# Altium project SVPXFMC_Carrier_6U.PrjPcb (part 4 of 9)

## Sheet FPGA SDRAM bank.SchDoc
size A3
Used 2 times, as channels FMC Carrier Channel1/U_FPGA SDRAM bank, FMC Carrier Channel2/U_FPGA SDRAM bank. Parts and nets are listed once, with the designators drawn on the sheet.
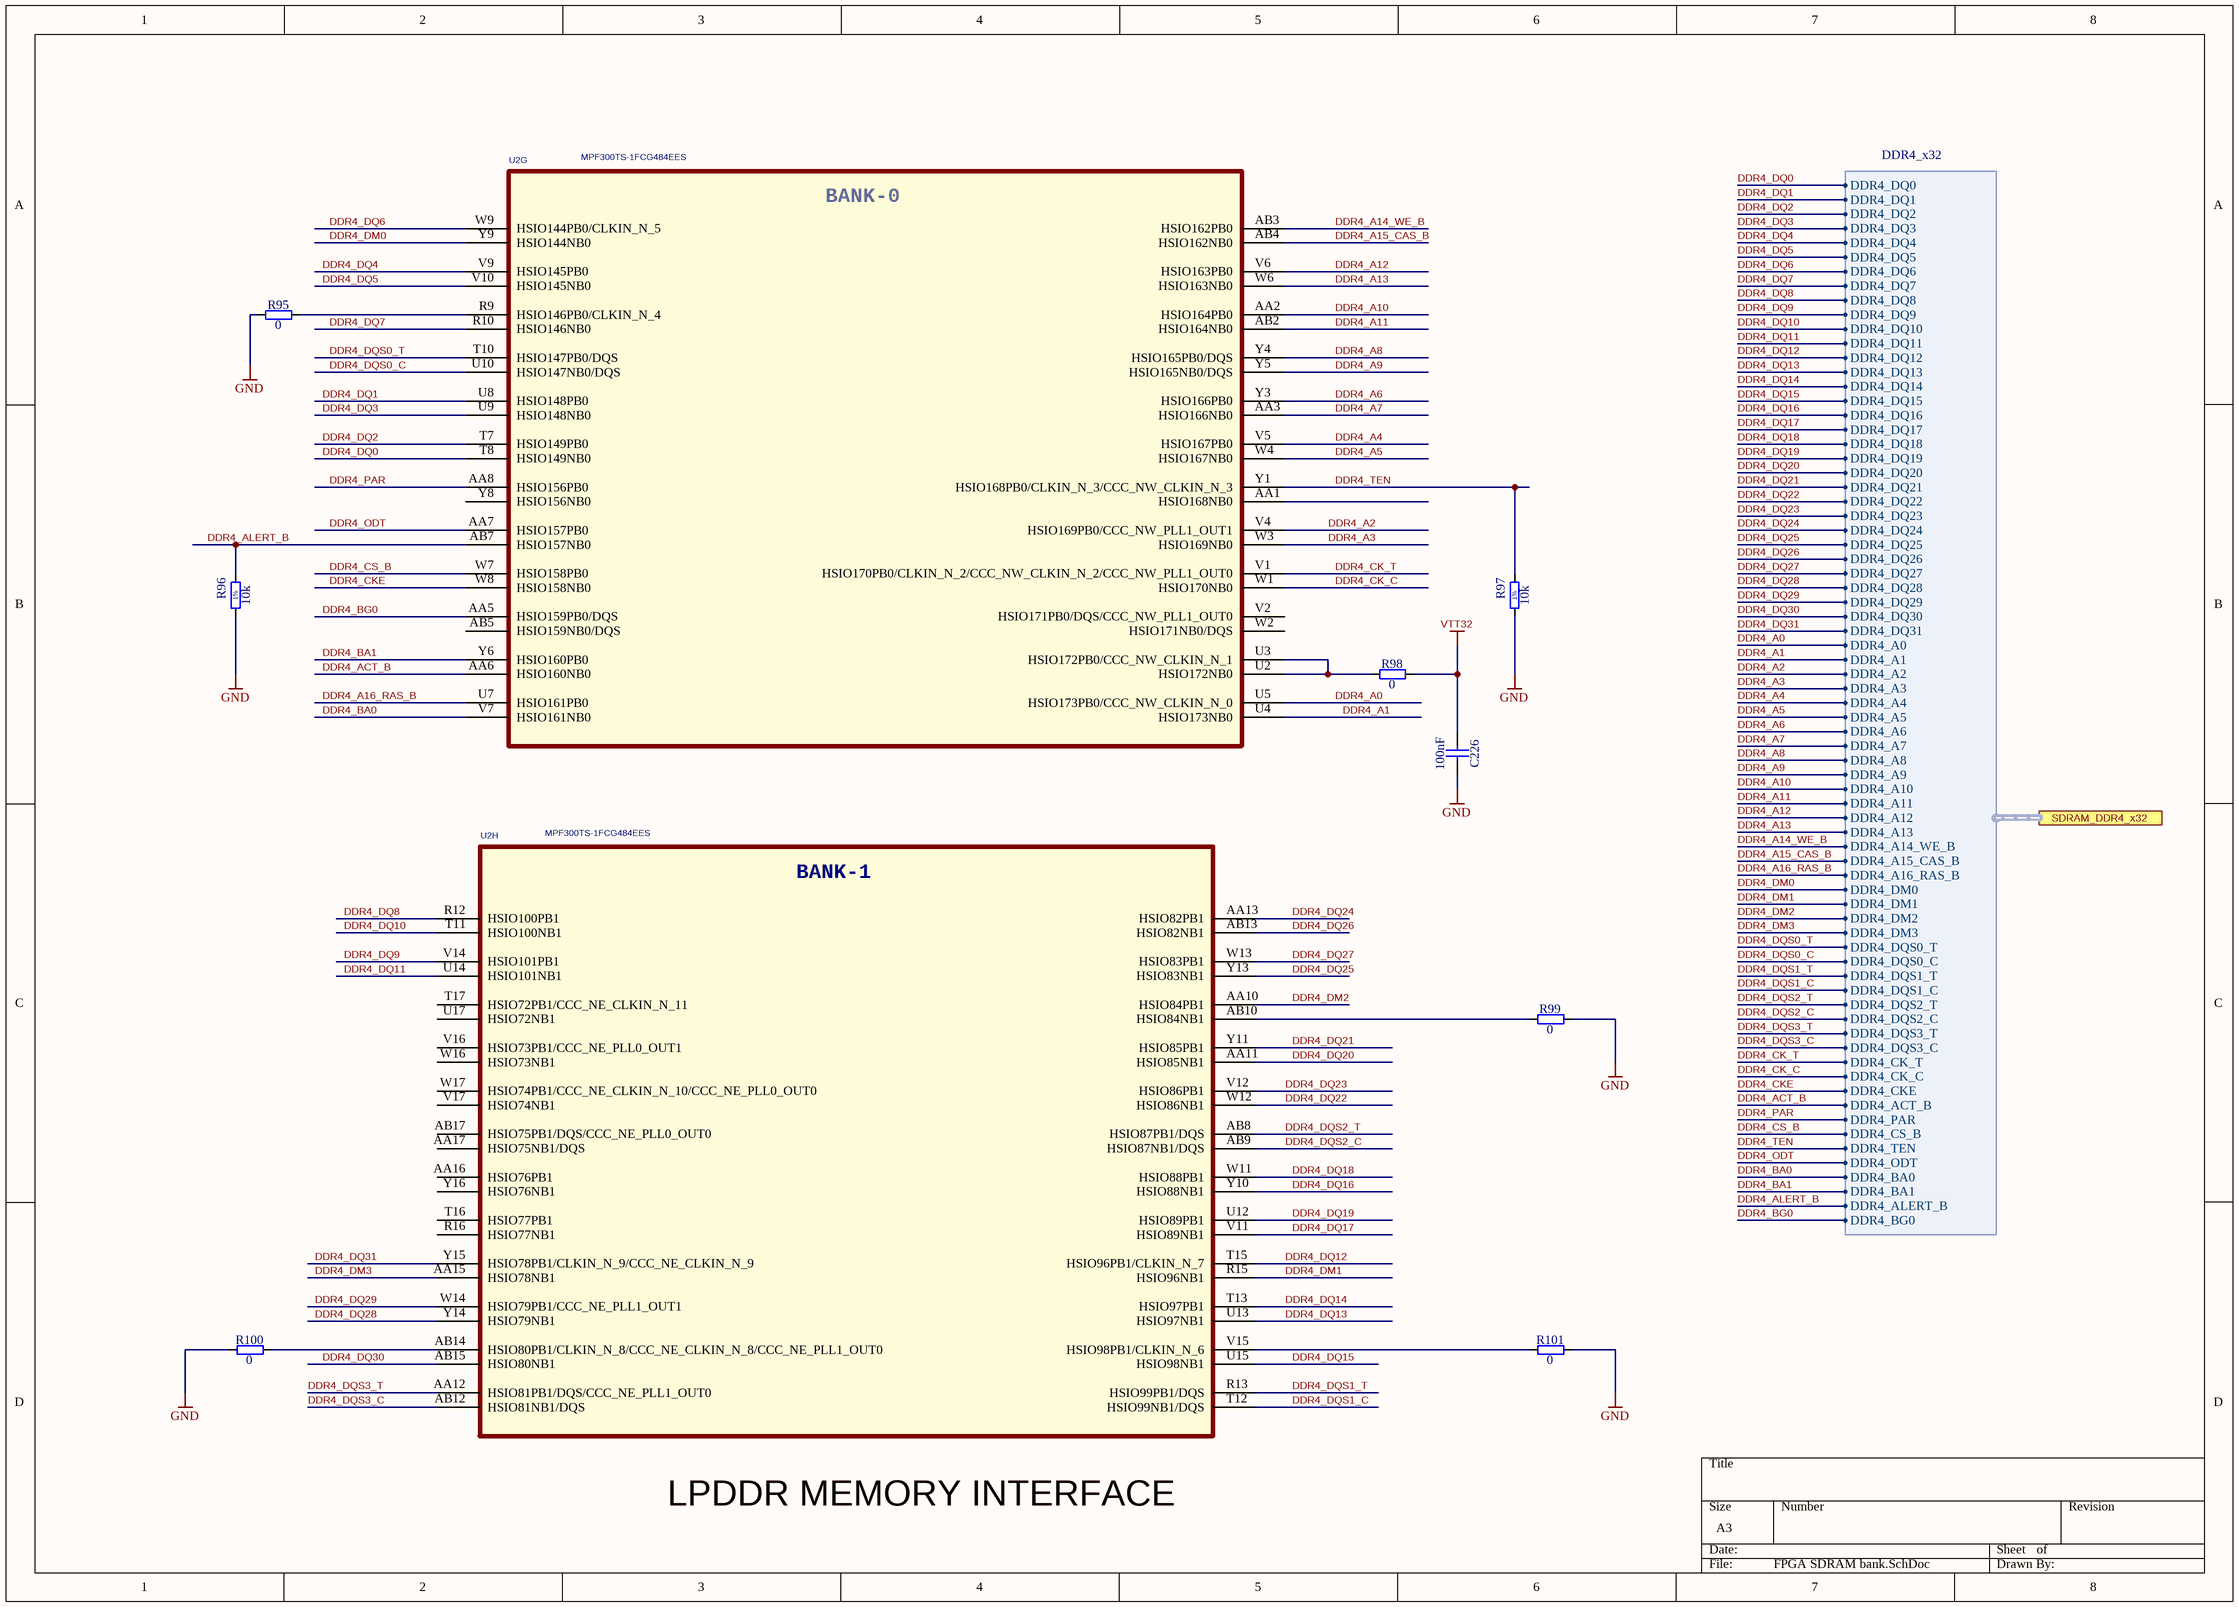
[diagram p11: FPGA SDRAM bank.SchDoc]

### Parts
C226  100nF  [CAPC0603X33N]
R95  0  [RESC1005X40N]
R96  10k  [RESC1005X40N]
R97  10k  [RESC1005X40N]
R98  0  [RESC1005X40N]
R99  0  [RESC1005X40N]
R100  0  [RESC1005X40N]
R101  0  [RESC1005X40N]
U2  MPF300TS-1FCG484EES  [BGA484C100P22X22_2300X2300X320]  (parts G,H of 11)

### Ports
SDRAM_DDR4_x32 (harness DDR4_x32)

### Harnesses
DDR4_x32: DDR4_DQ16, DDR4_DQ17, DDR4_DQ18, DDR4_DQ19, DDR4_DQ20, DDR4_DQ21, DDR4_DQ22, DDR4_DQ23, DDR4_DQ24, DDR4_DQ25, DDR4_DQ26, DDR4_DQ27, DDR4_DQ28, DDR4_DQ29, DDR4_DQ30, DDR4_DQ31, DDR4_A0, DDR4_A1, DDR4_A2, DDR4_A3, DDR4_A4, DDR4_A5, DDR4_A6, DDR4_A7, DDR4_A8, DDR4_A9, DDR4_A10, DDR4_A11, DDR4_A12, DDR4_A13, DDR4_A14_WE_B, DDR4_A15_CAS_B, DDR4_A16_RAS_B, DDR4_DM0, DDR4_DM1, DDR4_DM2, DDR4_DM3, DDR4_DQS0_T, DDR4_DQS0_C, DDR4_DQS1_T, DDR4_DQS1_C, DDR4_DQS2_T, DDR4_DQS2_C, DDR4_DQS3_T, DDR4_DQS3_C, DDR4_CK_T, DDR4_CK_C, DDR4_CKE, DDR4_ACT_B, DDR4_PAR, DDR4_CS_B, DDR4_TEN, DDR4_ODT, DDR4_BA0, DDR4_BA1, DDR4_ALERT_B, DDR4_BG0, DDR4_DQ0, DDR4_DQ1, DDR4_DQ2, DDR4_DQ3, DDR4_DQ4, DDR4_DQ5, DDR4_DQ6, DDR4_DQ7, DDR4_DQ8, DDR4_DQ9, DDR4_DQ10, DDR4_DQ11, DDR4_DQ12, DDR4_DQ13, DDR4_DQ14, DDR4_DQ15

### Nets
GND: C226.2 R95.1 R96.1 R97.1 R99.2 R100.1 R101.2
VTT32: C226.1 R98.2
DDR4_A0: U2.U5(HSIO173PB0/CCC_NW_CLKIN_N_0) ; port SDRAM_DDR4_x32.DDR4_A0
DDR4_A1: U2.U4(HSIO173NB0) ; port SDRAM_DDR4_x32.DDR4_A1
DDR4_A2: U2.V4(HSIO169PB0/CCC_NW_PLL1_OUT1) ; port SDRAM_DDR4_x32.DDR4_A2
DDR4_A3: U2.W3(HSIO169NB0) ; port SDRAM_DDR4_x32.DDR4_A3
DDR4_A4: U2.V5(HSIO167PB0) ; port SDRAM_DDR4_x32.DDR4_A4
DDR4_A5: U2.W4(HSIO167NB0) ; port SDRAM_DDR4_x32.DDR4_A5
DDR4_A6: U2.Y3(HSIO166PB0) ; port SDRAM_DDR4_x32.DDR4_A6
DDR4_A7: U2.AA3(HSIO166NB0) ; port SDRAM_DDR4_x32.DDR4_A7
DDR4_A8: U2.Y4(HSIO165PB0/DQS) ; port SDRAM_DDR4_x32.DDR4_A8
DDR4_A9: U2.Y5(HSIO165NB0/DQS) ; port SDRAM_DDR4_x32.DDR4_A9
DDR4_A10: U2.AA2(HSIO164PB0) ; port SDRAM_DDR4_x32.DDR4_A10
DDR4_A11: U2.AB2(HSIO164NB0) ; port SDRAM_DDR4_x32.DDR4_A11
DDR4_A12: U2.V6(HSIO163PB0) ; port SDRAM_DDR4_x32.DDR4_A12
DDR4_A13: U2.W6(HSIO163NB0) ; port SDRAM_DDR4_x32.DDR4_A13
DDR4_A14_WE_B: U2.AB3(HSIO162PB0) ; port SDRAM_DDR4_x32.DDR4_A14_WE_B
DDR4_A15_CAS_B: U2.AB4(HSIO162NB0) ; port SDRAM_DDR4_x32.DDR4_A15_CAS_B
DDR4_A16_RAS_B: U2.U7(HSIO161PB0) ; port SDRAM_DDR4_x32.DDR4_A16_RAS_B
DDR4_ACT_B: U2.AA6(HSIO160NB0) ; port SDRAM_DDR4_x32.DDR4_ACT_B
DDR4_ALERT_B: R96.2 U2.AB7(HSIO157NB0) ; port SDRAM_DDR4_x32.DDR4_ALERT_B
DDR4_BA0: U2.V7(HSIO161NB0) ; port SDRAM_DDR4_x32.DDR4_BA0
DDR4_BA1: U2.Y6(HSIO160PB0) ; port SDRAM_DDR4_x32.DDR4_BA1
DDR4_BG0: U2.AA5(HSIO159PB0/DQS) ; port SDRAM_DDR4_x32.DDR4_BG0
DDR4_CK_C: U2.W1(HSIO170NB0) ; port SDRAM_DDR4_x32.DDR4_CK_C
DDR4_CK_T: U2.V1(HSIO170PB0/CLKIN_N_2/CCC_NW_CLKIN_N_2/CCC_NW_PLL1_OUT0) ; port SDRAM_DDR4_x32.DDR4_CK_T
DDR4_CKE: U2.W8(HSIO158NB0) ; port SDRAM_DDR4_x32.DDR4_CKE
DDR4_CS_B: U2.W7(HSIO158PB0) ; port SDRAM_DDR4_x32.DDR4_CS_B
DDR4_DM0: U2.Y9(HSIO144NB0) ; port SDRAM_DDR4_x32.DDR4_DM0
DDR4_DM1: U2.R15(HSIO96NB1) ; port SDRAM_DDR4_x32.DDR4_DM1
DDR4_DM2: U2.AA10(HSIO84PB1) ; port SDRAM_DDR4_x32.DDR4_DM2
DDR4_DM3: U2.AA15(HSIO78NB1) ; port SDRAM_DDR4_x32.DDR4_DM3
DDR4_DQ0: U2.T8(HSIO149NB0) ; port SDRAM_DDR4_x32.DDR4_DQ0
DDR4_DQ1: U2.U8(HSIO148PB0) ; port SDRAM_DDR4_x32.DDR4_DQ1
DDR4_DQ2: U2.T7(HSIO149PB0) ; port SDRAM_DDR4_x32.DDR4_DQ2
DDR4_DQ3: U2.U9(HSIO148NB0) ; port SDRAM_DDR4_x32.DDR4_DQ3
DDR4_DQ4: U2.V9(HSIO145PB0) ; port SDRAM_DDR4_x32.DDR4_DQ4
DDR4_DQ5: U2.V10(HSIO145NB0) ; port SDRAM_DDR4_x32.DDR4_DQ5
DDR4_DQ6: U2.W9(HSIO144PB0/CLKIN_N_5) ; port SDRAM_DDR4_x32.DDR4_DQ6
DDR4_DQ7: U2.R10(HSIO146NB0) ; port SDRAM_DDR4_x32.DDR4_DQ7
DDR4_DQ8: U2.R12(HSIO100PB1) ; port SDRAM_DDR4_x32.DDR4_DQ8
DDR4_DQ9: U2.V14(HSIO101PB1) ; port SDRAM_DDR4_x32.DDR4_DQ9
DDR4_DQ10: U2.T11(HSIO100NB1) ; port SDRAM_DDR4_x32.DDR4_DQ10
DDR4_DQ11: U2.U14(HSIO101NB1) ; port SDRAM_DDR4_x32.DDR4_DQ11
DDR4_DQ12: U2.T15(HSIO96PB1/CLKIN_N_7) ; port SDRAM_DDR4_x32.DDR4_DQ12
DDR4_DQ13: U2.U13(HSIO97NB1) ; port SDRAM_DDR4_x32.DDR4_DQ13
DDR4_DQ14: U2.T13(HSIO97PB1) ; port SDRAM_DDR4_x32.DDR4_DQ14
DDR4_DQ15: U2.U15(HSIO98NB1) ; port SDRAM_DDR4_x32.DDR4_DQ15
DDR4_DQ16: U2.Y10(HSIO88NB1) ; port SDRAM_DDR4_x32.DDR4_DQ16
DDR4_DQ17: U2.V11(HSIO89NB1) ; port SDRAM_DDR4_x32.DDR4_DQ17
DDR4_DQ18: U2.W11(HSIO88PB1) ; port SDRAM_DDR4_x32.DDR4_DQ18
DDR4_DQ19: U2.U12(HSIO89PB1) ; port SDRAM_DDR4_x32.DDR4_DQ19
DDR4_DQ20: U2.AA11(HSIO85NB1) ; port SDRAM_DDR4_x32.DDR4_DQ20
DDR4_DQ21: U2.Y11(HSIO85PB1) ; port SDRAM_DDR4_x32.DDR4_DQ21
DDR4_DQ22: U2.W12(HSIO86NB1) ; port SDRAM_DDR4_x32.DDR4_DQ22
DDR4_DQ23: U2.V12(HSIO86PB1) ; port SDRAM_DDR4_x32.DDR4_DQ23
DDR4_DQ24: U2.AA13(HSIO82PB1) ; port SDRAM_DDR4_x32.DDR4_DQ24
DDR4_DQ25: U2.Y13(HSIO83NB1) ; port SDRAM_DDR4_x32.DDR4_DQ25
DDR4_DQ26: U2.AB13(HSIO82NB1) ; port SDRAM_DDR4_x32.DDR4_DQ26
DDR4_DQ27: U2.W13(HSIO83PB1) ; port SDRAM_DDR4_x32.DDR4_DQ27
DDR4_DQ28: U2.Y14(HSIO79NB1) ; port SDRAM_DDR4_x32.DDR4_DQ28
DDR4_DQ29: U2.W14(HSIO79PB1/CCC_NE_PLL1_OUT1) ; port SDRAM_DDR4_x32.DDR4_DQ29
DDR4_DQ30: U2.AB15(HSIO80NB1) ; port SDRAM_DDR4_x32.DDR4_DQ30
DDR4_DQ31: U2.Y15(HSIO78PB1/CLKIN_N_9/CCC_NE_CLKIN_N_9) ; port SDRAM_DDR4_x32.DDR4_DQ31
DDR4_DQS0_C: U2.U10(HSIO147NB0/DQS) ; port SDRAM_DDR4_x32.DDR4_DQS0_C
DDR4_DQS0_T: U2.T10(HSIO147PB0/DQS) ; port SDRAM_DDR4_x32.DDR4_DQS0_T
DDR4_DQS1_C: U2.T12(HSIO99NB1/DQS) ; port SDRAM_DDR4_x32.DDR4_DQS1_C
DDR4_DQS1_T: U2.R13(HSIO99PB1/DQS) ; port SDRAM_DDR4_x32.DDR4_DQS1_T
DDR4_DQS2_C: U2.AB9(HSIO87NB1/DQS) ; port SDRAM_DDR4_x32.DDR4_DQS2_C
DDR4_DQS2_T: U2.AB8(HSIO87PB1/DQS) ; port SDRAM_DDR4_x32.DDR4_DQS2_T
DDR4_DQS3_C: U2.AB12(HSIO81NB1/DQS) ; port SDRAM_DDR4_x32.DDR4_DQS3_C
DDR4_DQS3_T: U2.AA12(HSIO81PB1/DQS/CCC_NE_PLL1_OUT0) ; port SDRAM_DDR4_x32.DDR4_DQS3_T
DDR4_ODT: U2.AA7(HSIO157PB0) ; port SDRAM_DDR4_x32.DDR4_ODT
DDR4_PAR: U2.AA8(HSIO156PB0) ; port SDRAM_DDR4_x32.DDR4_PAR
DDR4_TEN: R97.2 U2.Y1(HSIO168PB0/CLKIN_N_3/CCC_NW_CLKIN_N_3) ; port SDRAM_DDR4_x32.DDR4_TEN
NetR95_2: R95.2 U2.R9(HSIO146PB0/CLKIN_N_4)
NetR98_1: R98.1 U2.U2(HSIO172NB0) U2.U3(HSIO172PB0/CCC_NW_CLKIN_N_1)
NetR99_1: R99.1 U2.AB10(HSIO84NB1)
NetR100_2: R100.2 U2.AB14(HSIO80PB1/CLKIN_N_8/CCC_NE_CLKIN_N_8/CCC_NE_PLL1_OUT0)
NetR101_1: R101.1 U2.V15(HSIO98PB1/CLKIN_N_6)

Not connected (* = marked no-connect by the designer): U2 AA1(HSIO168NB0) AA16(HSIO76PB1) AA17(HSIO75NB1/DQS) AB5(HSIO159NB0/DQS) AB17(HSIO75PB1/DQS/CCC_NE_PLL0_OUT0) R16(HSIO77NB1) T16(HSIO77PB1) T17(HSIO72PB1/CCC_NE_CLKIN_N_11) U17(HSIO72NB1) V2(HSIO171PB0/DQS/CCC_NW_PLL1_OUT0) V16(HSIO73PB1/CCC_NE_PLL0_OUT1) V17(HSIO74NB1) W2(HSIO171NB0/DQS) W16(HSIO73NB1) W17(HSIO74PB1/CCC_NE_CLKIN_N_10/CCC_NE_PLL0_OUT0) Y8(HSIO156NB0) Y16(HSIO76NB1)

### Channels
FMC Carrier Channel1/U_FPGA SDRAM bank: designators C226=C226A R95=R95A R96=R96A R97=R97A R98=R98A R99=R99A R100=R100A R101=R101A U2=U2A#4
FMC Carrier Channel2/U_FPGA SDRAM bank: designators C226=C226B R95=R95B R96=R96B R97=R97B R98=R98B R99=R99B R100=R100B R101=R101B U2=U2B#4

### Notes on the sheet
- LPDDR MEMORY INTERFACE
- (in symbol FPGA_MPF300T-FCG484, part G) BANK-0
- (in symbol FPGA_MPF300T-FCG484, part H) BANK-1
- (in symbol R0402_10K_1%_0.0625W_100PPM) 1%

### Library data of the parts
C226 = CC0201_100NF_6.3V_10%_X5R: Non-polarised capacitor; Manufacturer: GENERIC; Part Description: SMD Multilayer Chip Ceramic Capacitor; Manufacturer1 Part Number: 02016D104KAT2A; Tolerance: ±10%; Voltage: 6.3V; TC: X5R; Manufacturer Part Number: CC0201_100NF_6.3V_10%_X5R; Part Number: CC0201_100NF_6.3V_10%_X5R; Value: 100nF; Component Kind: Standard; Component Type: Standard; Pin Count: 2; Status: Not Recommended; Case: 0201; Mounted: Yes; Socket: No; SMD: Yes; Sense: No; Manufacturer1 Example: AVX; Manufacturer1 ComponentHeight: 0.33mm; HelpURL: \\cern.ch\dfs\Applications\Altium\Datasheets\CC0201_X5R_AVX.pdf; Author: CERN DEM JLC; CreateDate: 03/12/2007; LatestRevisionDate: 03/12/2007
R95 R98-R101 = R0402_0R_JUMPER: Resistor; Part Description: 1A (0.05R Max DC Resistance) Zero Ohm Jumper; Manufacturer: GENERIC; Manufacturer1 Part Number: 232270591001L; PressFit: No; Part Number: R0402_0R_JUMPER; Component Kind: Standard; Component Type: Standard; Pin Count: 2; Value: 0; Status: Not Recommended; Manufacturer Part Number: R0402_0R_JUMPER; Case: 0402; Mounted: Yes; Sense: No; Socket: No; SMD: Yes; Manufacturer1 Example: YAGEO PHYCOMP; Manufacturer1 ComponentHeight: 0.4mm; HelpURL: \\cern.ch\dfs\Applications\Altium\Datasheets\R0402_Phycomp_RC0402.pdf; Author: CERN DEM JLC; CreateDate: 03/12/2007; LatestRevisionDate: 17/10/2012
R96 R97 = R0402_10K_1%_0.0625W_100PPM: Resistor - 1%; Manufacturer: GENERIC; Part Description: General Purpose Thick Film Chip Resistor; Manufacturer1 Part Number: 232270671003L; TC: ±100ppm/°C; PressFit: No; Manufacturer Part Number: R0402_10K_1%_0.0625W_100PPM; Part Number: R0402_10K_1%_0.0625W_100PPM; Tolerance: ±1%; Value: 10k; Component Kind: Standard; Component Type: Standard; Pin Count: 2; Status: Not Recommended; Power: 0.0625W; Case: 0402; Mounted: Yes; Sense: No; Socket: No; SMD: Yes; Manufacturer1 Example: YAGEO PHYCOMP; Manufacturer1 ComponentHeight: 0.4mm; HelpURL: \\cern.ch\dfs\Applications\Altium\Datasheets\R0402_Phycomp_RC0402.pdf; Author: CERN DEM JLC; CreateDate: 03/12/2007; LatestRevisionDate: 17/10/2012
U2 = FPGA_MPF300T-FCG484: as U2 on sheet FPGA_RGMII_Misc

## Sheet FPGA Supply.SchDoc
size A3
Used 2 times, as channels FMC Carrier Channel1/U_FPGA Supply, FMC Carrier Channel2/U_FPGA Supply. Parts and nets are listed once, with the designators drawn on the sheet.
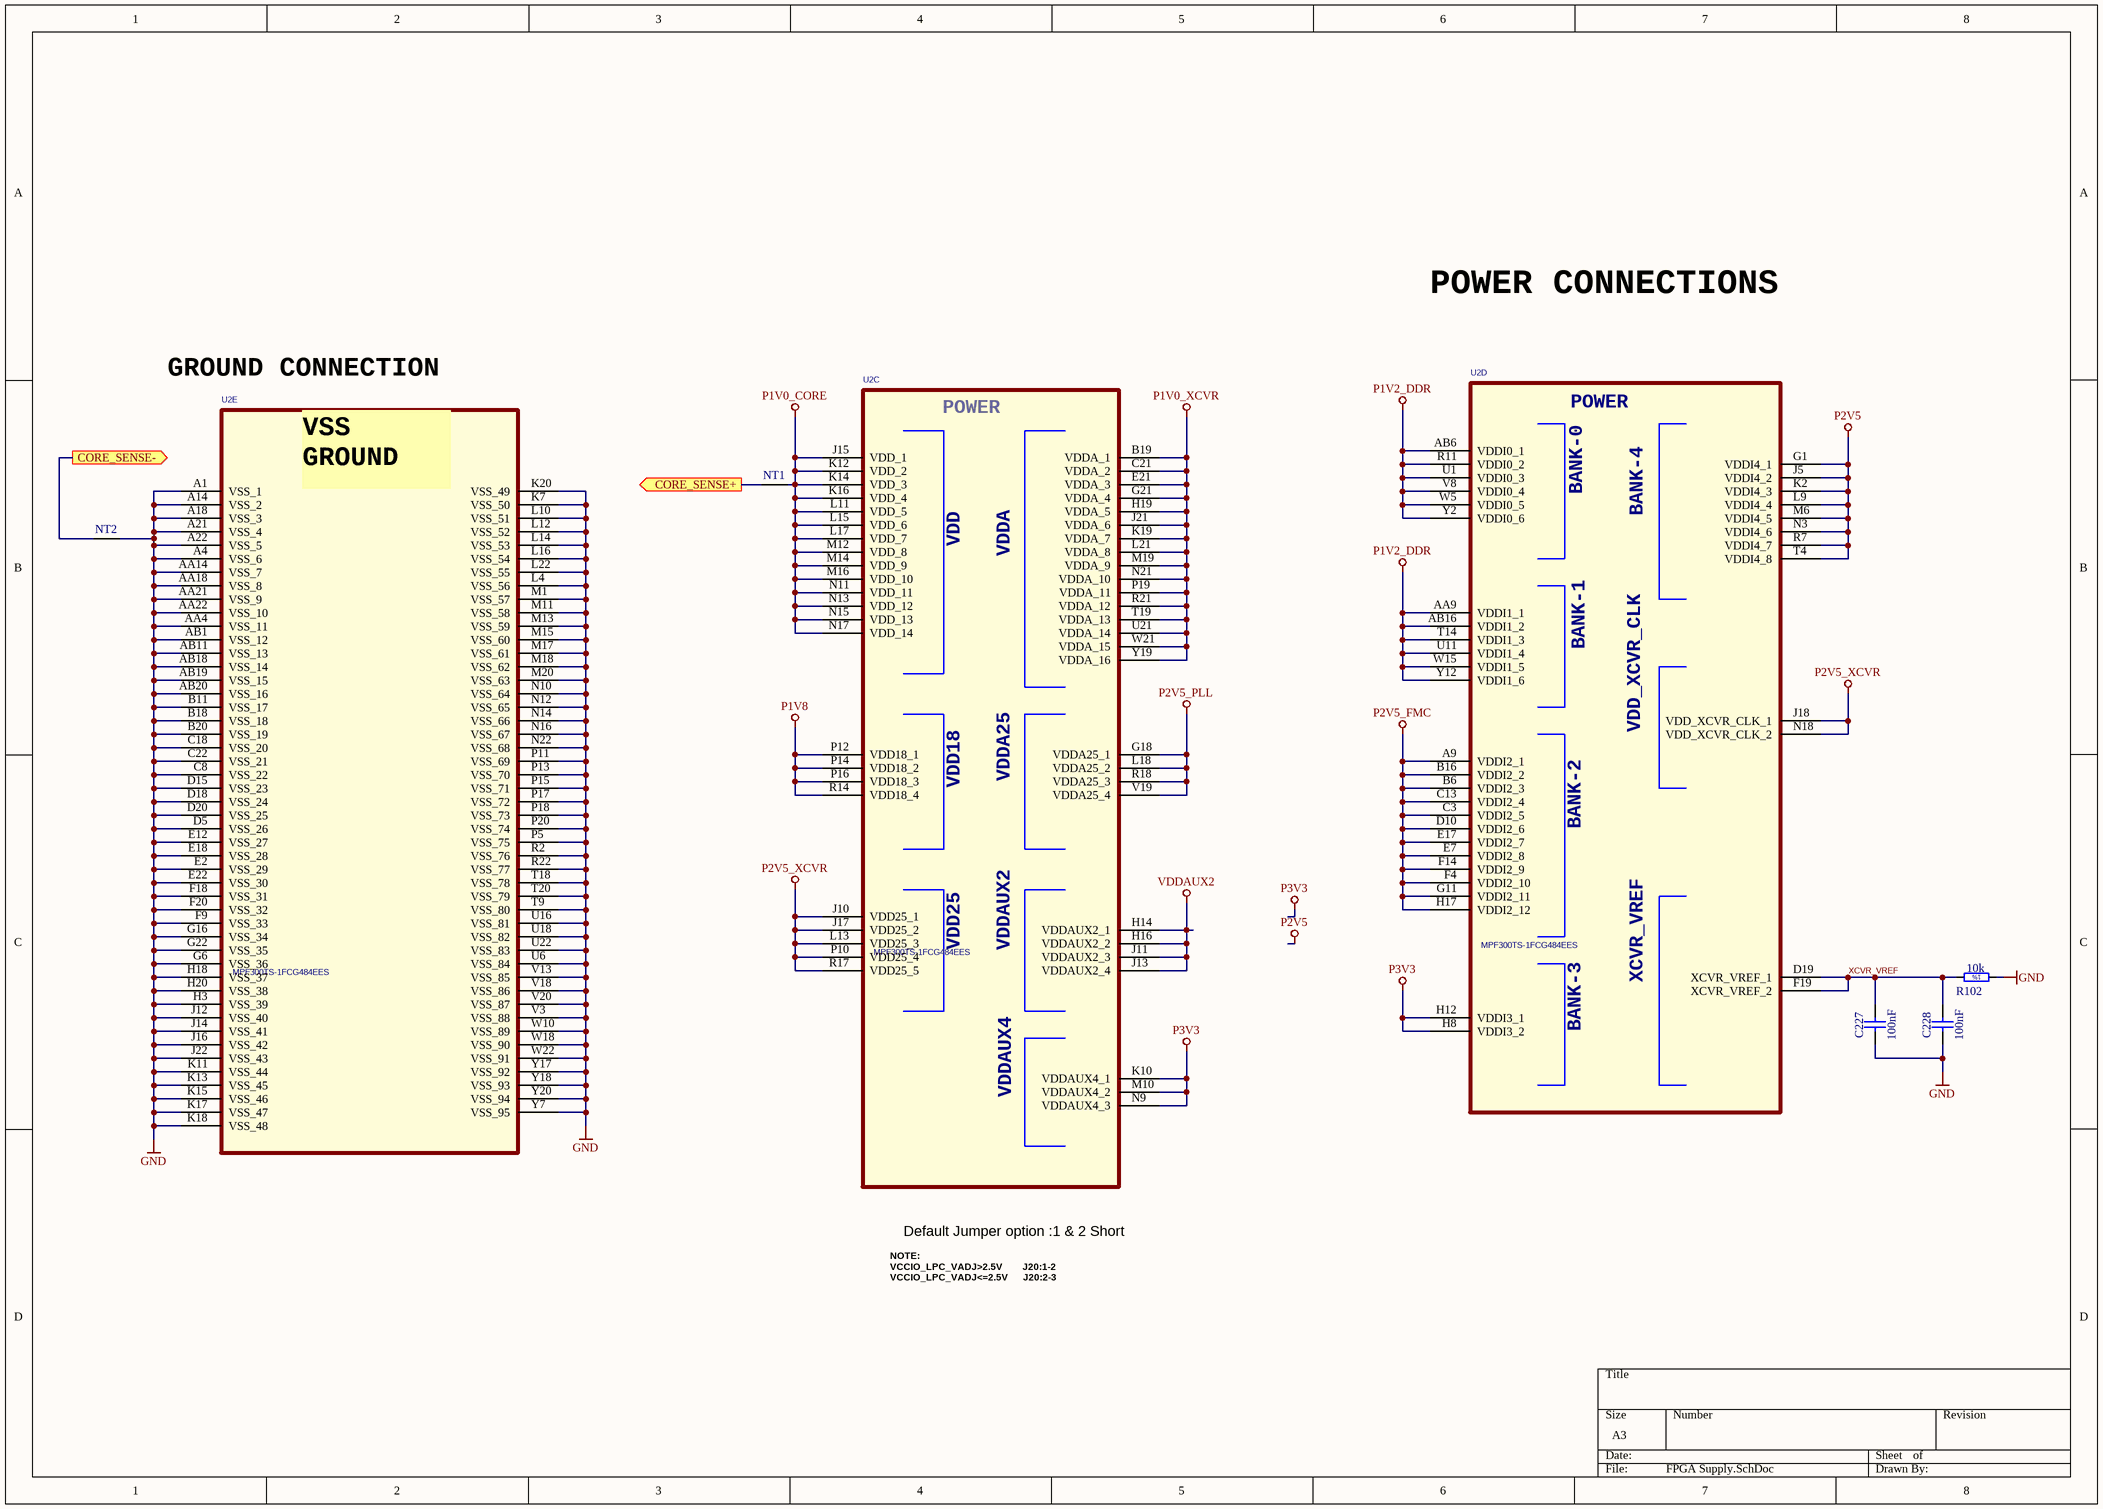
[diagram p12: FPGA Supply.SchDoc]

### Parts
C227  100nF  [CAPC0603X33N]
C228  100nF  [CAPC0603X33N]
NT1  Net Tie  [Net Tie]  (value not drawn)  (net tie, no BOM)
NT2  Net Tie  [Net Tie]  (value not drawn)  (net tie, no BOM)
R102  10k  [RESC1005X40N]
U2  MPF300TS-1FCG484EES  [BGA484C100P22X22_2300X2300X320]  (parts C,D,E of 11)

### Ports
CORE_SENSE+ (out), CORE_SENSE- (out)

### Nets
GND: C227.1 C228.1 NT2.2 R102.1 U2.A1(VSS_1) U2.A4(VSS_6) U2.A14(VSS_2) U2.A18(VSS_3) U2.A21(VSS_4) U2.A22(VSS_5) U2.AA4(VSS_11) U2.AA14(VSS_7) U2.AA18(VSS_8) U2.AA21(VSS_9) U2.AA22(VSS_10) U2.AB1(VSS_12) U2.AB11(VSS_13) U2.AB18(VSS_14) U2.AB19(VSS_15) U2.AB20(VSS_16) U2.B11(VSS_17) U2.B18(VSS_18) U2.B20(VSS_19) U2.C8(VSS_22) U2.C18(VSS_20) U2.C22(VSS_21) U2.D5(VSS_26) U2.D15(VSS_23) U2.D18(VSS_24) U2.D20(VSS_25) U2.E2(VSS_29) U2.E12(VSS_27) U2.E18(VSS_28) U2.E22(VSS_30) U2.F9(VSS_33) U2.F18(VSS_31) U2.F20(VSS_32) U2.G6(VSS_36) U2.G16(VSS_34) U2.G22(VSS_35) U2.H3(VSS_39) U2.H18(VSS_37) U2.H20(VSS_38) U2.J12(VSS_40) U2.J14(VSS_41) U2.J16(VSS_42) U2.J22(VSS_43) U2.K7(VSS_50) U2.K11(VSS_44) U2.K13(VSS_45) U2.K15(VSS_46) U2.K17(VSS_47) U2.K18(VSS_48) U2.K20(VSS_49) U2.L4(VSS_56) U2.L10(VSS_51) U2.L12(VSS_52) U2.L14(VSS_53) U2.L16(VSS_54) U2.L22(VSS_55) U2.M1(VSS_57) U2.M11(VSS_58) U2.M13(VSS_59) U2.M15(VSS_60) U2.M17(VSS_61) U2.M18(VSS_62) U2.M20(VSS_63) U2.N10(VSS_64) U2.N12(VSS_65) U2.N14(VSS_66) U2.N16(VSS_67) U2.N22(VSS_68) U2.P5(VSS_75) U2.P11(VSS_69) U2.P13(VSS_70) U2.P15(VSS_71) U2.P17(VSS_72) U2.P18(VSS_73) U2.P20(VSS_74) U2.R2(VSS_76) U2.R22(VSS_77) U2.T9(VSS_80) U2.T18(VSS_78) U2.T20(VSS_79) U2.U6(VSS_84) U2.U16(VSS_81) U2.U18(VSS_82) U2.U22(VSS_83) U2.V3(VSS_88) U2.V13(VSS_85) U2.V18(VSS_86) U2.V20(VSS_87) U2.W10(VSS_89) U2.W18(VSS_90) U2.W22(VSS_91) U2.Y7(VSS_95) U2.Y17(VSS_92) U2.Y18(VSS_93) U2.Y20(VSS_94)
P1V0_CORE: NT1.2 U2.J15(VDD_1) U2.K12(VDD_2) U2.K14(VDD_3) U2.K16(VDD_4) U2.L11(VDD_5) U2.L15(VDD_6) U2.L17(VDD_7) U2.M12(VDD_8) U2.M14(VDD_9) U2.M16(VDD_10) U2.N11(VDD_11) U2.N13(VDD_12) U2.N15(VDD_13) U2.N17(VDD_14)
P1V0_XCVR: U2.B19(VDDA_1) U2.C21(VDDA_2) U2.E21(VDDA_3) U2.G21(VDDA_4) U2.H19(VDDA_5) U2.J21(VDDA_6) U2.K19(VDDA_7) U2.L21(VDDA_8) U2.M19(VDDA_9) U2.N21(VDDA_10) U2.P19(VDDA_11) U2.R21(VDDA_12) U2.T19(VDDA_13) U2.U21(VDDA_14) U2.W21(VDDA_15) U2.Y19(VDDA_16)
P1V2_DDR: U2.AA9(VDDI1_1) U2.AB6(VDDI0_1) U2.AB16(VDDI1_2) U2.R11(VDDI0_2) U2.T14(VDDI1_3) U2.U1(VDDI0_3) U2.U11(VDDI1_4) U2.V8(VDDI0_4) U2.W5(VDDI0_5) U2.W15(VDDI1_5) U2.Y2(VDDI0_6) U2.Y12(VDDI1_6)
P1V8: U2.P12(VDD18_1) U2.P14(VDD18_2) U2.P16(VDD18_3) U2.R14(VDD18_4)
P2V5: U2.G1(VDDI4_1) U2.J5(VDDI4_2) U2.K2(VDDI4_3) U2.L9(VDDI4_4) U2.M6(VDDI4_5) U2.N3(VDDI4_6) U2.R7(VDDI4_7) U2.T4(VDDI4_8)
P2V5_FMC: U2.A9(VDDI2_1) U2.B6(VDDI2_3) U2.B16(VDDI2_2) U2.C3(VDDI2_5) U2.C13(VDDI2_4) U2.D10(VDDI2_6) U2.E7(VDDI2_8) U2.E17(VDDI2_7) U2.F4(VDDI2_10) U2.F14(VDDI2_9) U2.G11(VDDI2_11) U2.H17(VDDI2_12)
P2V5_PLL: U2.G18(VDDA25_1) U2.L18(VDDA25_2) U2.R18(VDDA25_3) U2.V19(VDDA25_4)
P2V5_XCVR: U2.J10(VDD25_1) U2.J17(VDD25_2) U2.J18(VDD_XCVR_CLK_1) U2.L13(VDD25_3) U2.N18(VDD_XCVR_CLK_2) U2.P10(VDD25_4) U2.R17(VDD25_5)
P3V3: U2.H8(VDDI3_2) U2.H12(VDDI3_1) U2.K10(VDDAUX4_1) U2.M10(VDDAUX4_2) U2.N9(VDDAUX4_3)
VDDAUX2: U2.H14(VDDAUX2_1) U2.H16(VDDAUX2_2) U2.J11(VDDAUX2_3) U2.J13(VDDAUX2_4)
CORE_SENSE+: NT1.1 ; port CORE_SENSE+
CORE_SENSE-: NT2.1 ; port CORE_SENSE-
XCVR_VREF: C227.2 C228.2 R102.2 U2.D19(XCVR_VREF_1) U2.F19(XCVR_VREF_2)

### Channels
FMC Carrier Channel1/U_FPGA Supply: designators C227=C227A C228=C228A NT1=NT1A NT2=NT2A R102=R102A U2=U2A#5; ports CORE_SENSE+=NetNT1A_1 CORE_SENSE-=NetNT2A_1
FMC Carrier Channel2/U_FPGA Supply: designators C227=C227B C228=C228B NT1=NT1B NT2=NT2B R102=R102B U2=U2B#5; ports CORE_SENSE+=NetNT1B_1 CORE_SENSE-=NetNT2B_1

### Notes on the sheet
- POWER CONNECTIONS
- GROUND CONNECTION
- Default Jumper option :1 & 2 Short
- NOTE:
  VCCIO_LPC_VADJ>2.5V        J20:1-2
  VCCIO_LPC_VADJ<=2.5V      J20:2-3
- (in symbol FPGA_MPF300T-FCG484, part C) POWER; VDD; VDDA; VDDA25; VDD18; VDD25; VDDAUX2; VDDAUX4
- (in symbol FPGA_MPF300T-FCG484, part D) POWER; BANK-0; BANK-4; BANK-1; VDD_XCVR_CLK; BANK-2; XCVR_VREF; BANK-3
- (in symbol FPGA_MPF300T-FCG484, part E) VSS / GROUND
- (in symbol R0402_10K_1%_0.0625W_100PPM) 1%

### Library data of the parts
C227 C228 = CC0201_100NF_6.3V_10%_X5R: as C225 on sheet FPGA_RGMII_Misc; Part Number: CC0201_100NF_6.3V_10%_X5R; Component Kind: Standard; Component Type: Standard; Pin Count: 2; Value: 100nF; Status: Not Recommended; Manufacturer Part Number: CC0201_100NF_6.3V_10%_X5R; Case: 0201; Mounted: Yes; Socket: No; SMD: Yes; Sense: No; Manufacturer1 Example: AVX; Manufacturer1 ComponentHeight: 0.33mm; HelpURL: \\cern.ch\dfs\Applications\Altium\Datasheets\CC0201_X5R_AVX.pdf; Author: CERN DEM JLC; CreateDate: 03/12/2007; LatestRevisionDate: 03/12/2007
NT1 NT2 = Net Tie: Part Description: Net Tie (2 Nets); Mounted: No; Part Number: Net Tie; Component Type: Net Tie; Pin Count: 2; Family: Net Tie; Socket: No; SMD: No; Sense: No; Status: None; ComponentHeight: 0mm; HelpURL: Undefined; Author: CERN DEM JLC; CreateDate: 22/03/2011; LatestRevisionDate: 22/03/2011; PackageDescription: 2 Plated Through Hole For Coaxial Cable Link: Hole Dia.=1.4mm Pad Dia.=2.5mm
R102 = R0402_10K_1%_0.0625W_100PPM: as R96 on sheet FPGA SDRAM bank; Manufacturer Part Number: R0402_10K_1%_0.0625W_100PPM; Part Number: R0402_10K_1%_0.0625W_100PPM; Tolerance: ±1%; Value: 10k; Component Kind: Standard; Component Type: Standard; Pin Count: 2; Status: Not Recommended; Power: 0.0625W; Case: 0402; Mounted: Yes; Sense: No; Socket: No; SMD: Yes; Manufacturer1 Example: YAGEO PHYCOMP; Manufacturer1 ComponentHeight: 0.4mm; HelpURL: \\cern.ch\dfs\Applications\Altium\Datasheets\R0402_Phycomp_RC0402.pdf; Author: CERN DEM JLC; CreateDate: 03/12/2007; LatestRevisionDate: 17/10/2012
U2 = FPGA_MPF300T-FCG484: as U2 on sheet FPGA_RGMII_Misc